# Altium schematic sheet SAM4N_Xplained_Pro_Target_MCU.SchDoc: Target MCU
size A3; Organization: ATMEL Norway; Address1: Vestre Rosten 79; Address2: N-7075 TILLER; Address3: NORWAY; DocumentNumber: A09-1967; Revision: 2; SheetNumber: 4; SheetTotal: 6; PageSetup: Record=PageOptions|CenterHorizontal=True|CenterVertical=True|PrintScale=1.01|XCorrection=1.00|YCorrection=1.00|PrintKind=1|BorderSize=5000000|LeftOffset=0|BottomOffset=0|Orientation=2|PaperLength=1000|PaperWidth=1000|Scale=100|PaperSource=7|PrintQuality=-4|MediaType=1|DitherType=10|PaperKind=A3 (297 x 420 mm)|PrintScaleMode=1
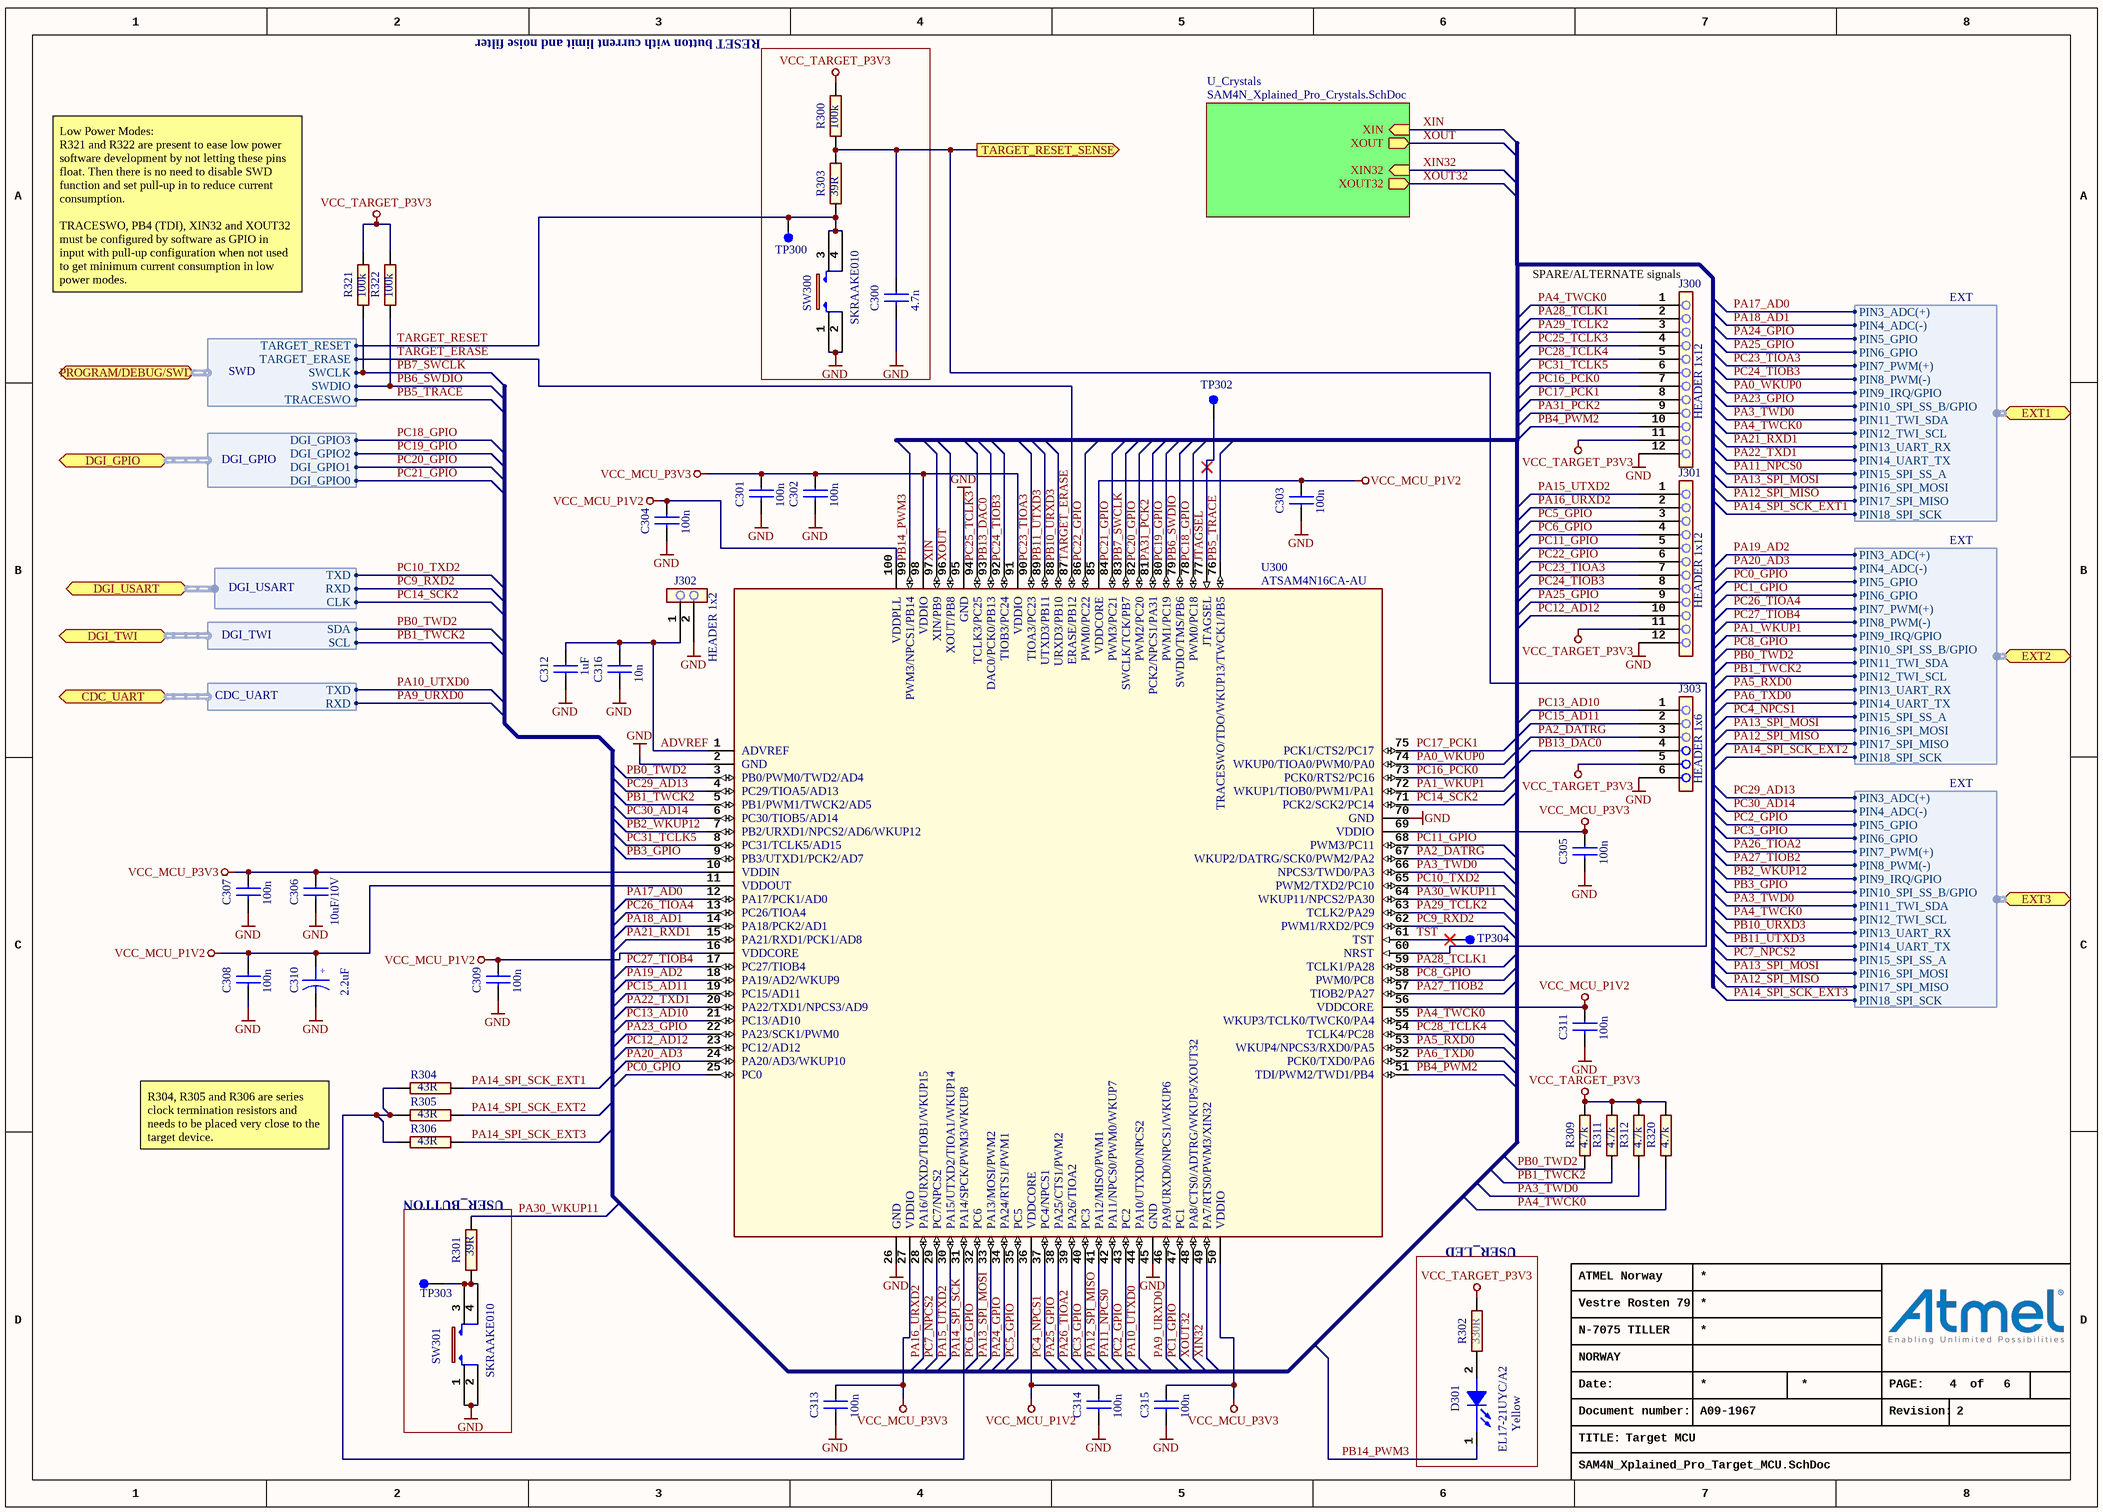
[diagram p0: SAM4N_Xplained_Pro_Target_MCU.SchDoc]

## Parts
C300  value 4.7n  [AP1-00001]  (hidden comment: CAP-NONPOL)
C301  value 100n  [AP1-00001]  (hidden comment: CAP-NONPOL)
C302  value 100n  [AP1-00001]  (hidden comment: CAP-NONPOL)
C303  value 100n  [AP1-00001]  (hidden comment: CAP-NONPOL)
C304  value 100n  [AP1-00001]  (hidden comment: CAP-NONPOL)
C305  value 100n  [AP1-00001]  (hidden comment: CAP-NONPOL)
C306  value 10uF/10V  [AP1-00039]  (hidden comment: CAP-NONPOL)
C307  value 100n  [AP1-00001]  (hidden comment: CAP-NONPOL)
C308  value 100n  [AP1-00001]  (hidden comment: CAP-NONPOL)
C309  value 100n  [AP1-00001]  (hidden comment: CAP-NONPOL)
C310  value 2.2uF  [AP1-00036]  (hidden comment: CAP-POL)
C311  value 100n  [AP1-00001]  (hidden comment: CAP-NONPOL)
C312  value 1uF  [AP1-00038]  (hidden comment: CAP-NONPOL)
C313  value 100n  [AP1-00001]  (hidden comment: CAP-NONPOL)
C314  value 100n  [AP1-00001]  (hidden comment: CAP-NONPOL)
C315  value 100n  [AP1-00001]  (hidden comment: CAP-NONPOL)
C316  value 10n  [AP1-00001]  (hidden comment: CAP-NONPOL)
D301  Yellow  value EL17-21UYC/A2  [AP4-00013]
J300  HEADER 1x12  [AP8-00677]
J301  HEADER 1x12  [AP8-00677]
J302  HEADER 1x2  [AP8-00733]
J303  HEADER 1x6  [AP8-00676]
R300  value 100k  [AP2-00000]  (hidden comment: R2)
R301  value 39R  [AP2-00000]  (hidden comment: R2)
R302  value 330R  [AP2-00000]  (hidden comment: R2)
R303  value 39R  [AP2-00000]  (hidden comment: R2)
R304  value 43R  [AP2-00000]  (hidden comment: R2)
R305  value 43R  [AP2-00000]  (hidden comment: R2)
R306  value 43R  [AP2-00000]  (hidden comment: R2)
R309  value 4.7k  [AP2-00000]  (hidden comment: R2)
R311  value 4.7k  [AP2-00000]  (hidden comment: R2)
R312  value 4.7k  [AP2-00000]  (hidden comment: R2)
R320  value 4.7k  [AP2-00000]  (hidden comment: R2)
R321  value 100k  [AP2-00000]  (hidden comment: R2)
R322  value 100k  [AP2-00000]  (hidden comment: R2)
SW300  value SKRAAKE010  [AP8-00137]  (hidden comment: Can be ordered in low volumes from Mouser)
SW301  value SKRAAKE010  [AP8-00137]  (hidden comment: Can be ordered in low volumes from Mouser)
TP300  TESTPAD  [AP8-00010]  (value not drawn)  (no BOM)
TP302  TESTPOINT  [AP8-00010]  (value not drawn)  (no BOM)
TP303  TESTPAD  [AP8-00010]  (value not drawn)  (no BOM)
TP304  TESTPOINT  [AP8-00010]  (value not drawn)  (no BOM)
U300  value ATSAM4N16CA-AU  [AP6-00292]  (hidden comment: SAM4N_100LPQF)

## Blocks framed on the sheet
RESET button with current limit and noise filter: C300 R300 R303 SW300 TP300
USER_BUTTON: R301 SW301 TP303
USER_LED: D301 R302

## Sub-sheets
U_Crystals = SAM4N_Xplained_Pro_Crystals.SchDoc: XIN (in), XOUT (out), XIN32 (in), XOUT32 (out)

## Ports
CDC_UART (harness CDC_UART), DGI_GPIO (harness DGI_GPIO), DGI_TWI (harness DGI_TWI), DGI_USART (harness DGI_USART), EXT1 (harness EXT), EXT2 (harness EXT), EXT3 (harness EXT), PROGRAM/DEBUG/SWD (harness SWD), TARGET_RESET_SENSE (out)

## Harnesses
SWD: SWCLK, SWDIO, TRACESWO, TARGET_RESET, TARGET_ERASE
DGI_GPIO: DGI_GPIO0, DGI_GPIO1, DGI_GPIO2, DGI_GPIO3
DGI_TWI: SCL, SDA
CDC_UART: RXD, TXD
EXT: PIN10_SPI_SS_B/GPIO, PIN11_TWI_SDA, PIN12_TWI_SCL, PIN13_UART_RX, PIN14_UART_TX, PIN15_SPI_SS_A, PIN16_SPI_MOSI, PIN17_SPI_MISO, PIN18_SPI_SCK, PIN3_ADC(+), PIN4_ADC(-), PIN5_GPIO, PIN6_GPIO, PIN7_PWM(+), PIN8_PWM(-), PIN9_IRQ/GPIO
DGI_USART: CLK, RXD, TXD

## Nets
GND: C300.2 C301.2 C302.2 C303.2 C304.2 C305.2 C306.2 C307.2 C308.2 C309.2 C310.2 C311.2 C312.2 C313.2 C314.2 C315.2 C316.2 J300.12 J301.12 J302.2 J303.6 SW300.1 SW300.2 SW301.1 SW301.2 U300.2(GND_2) U300.26(GND_26) U300.45(GND_45) U300.70(GND_70) U300.95(GND_95)
VCC_MCU_P1V2: C303.1 C304.1 C308.1 C309.1 C310.1 C311.1 C314.1 U300.11(VDDOUT) U300.16(VDDCORE_16) U300.36(VDDCORE_36) U300.56(VDDCORE_56) U300.85(VDDCORE_85) U300.100(VDDPLL)
VCC_MCU_P3V3: C301.1 C302.1 C305.1 C306.1 C307.1 C313.1 C315.1 U300.10(VDDIN) U300.27(VDDIO_27) U300.50(VDDIO_50) U300.69(VDDIO_69) U300.91(VDDIO_91) U300.98(VDDIO_98)
VCC_TARGET_P3V3: J300.11 J301.11 J303.5 R300.2 R302.2 R309.2 R311.2 R312.2 R320.2 R321.2 R322.2
ADVREF: C312.1 C316.1 J302.1 U300.1(ADVREF)
JTAGSEL: TP302.1 U300.77(JTAGSEL)
PA0_WKUP0: U300.74(PA0) ; port EXT1.PIN9_IRQ/GPIO
PA1_WKUP1: U300.72(PA1) ; port EXT2.PIN9_IRQ/GPIO
PA2_DATRG: J303.3 U300.67(PA2)
PA3_TWD0: R312.1 U300.66(PA3) ; port EXT1.PIN11_TWI_SDA, port EXT3.PIN11_TWI_SDA
PA4_TWCK0: J300.1 R320.1 U300.55(PA4) ; port EXT1.PIN12_TWI_SCL, port EXT3.PIN12_TWI_SCL
PA5_RXD0: U300.53(PA5) ; port EXT2.PIN13_UART_RX
PA6_TXD0: U300.52(PA6) ; port EXT2.PIN14_UART_TX
PA9_URXD0: U300.46(PA9) ; port CDC_UART.RXD
PA10_UTXD0: U300.44(PA10) ; port CDC_UART.TXD
PA11_NPCS0: U300.42(PA11) ; port EXT1.PIN15_SPI_SS_A
PA12_SPI_MISO: U300.41(PA12) ; port EXT1.PIN17_SPI_MISO, port EXT2.PIN17_SPI_MISO, port EXT3.PIN17_SPI_MISO
PA13_SPI_MOSI: U300.33(PA13) ; port EXT1.PIN16_SPI_MOSI, port EXT2.PIN16_SPI_MOSI, port EXT3.PIN16_SPI_MOSI
PA14_SPI_SCK: R304.2 R305.2 R306.2 U300.31(PA14)
PA14_SPI_SCK_EXT1: R304.1 ; port EXT1.PIN18_SPI_SCK
PA14_SPI_SCK_EXT2: R305.1 ; port EXT2.PIN18_SPI_SCK
PA14_SPI_SCK_EXT3: R306.1 ; port EXT3.PIN18_SPI_SCK
PA15_UTXD2: J301.1 U300.30(PA15)
PA16_URXD2: J301.2 U300.28(PA16)
PA17_AD0: U300.12(PA17) ; port EXT1.PIN3_ADC(+)
PA18_AD1: U300.14(PA18) ; port EXT1.PIN4_ADC(-)
PA19_AD2: U300.18(PA19) ; port EXT2.PIN3_ADC(+)
PA20_AD3: U300.24(PA20) ; port EXT2.PIN4_ADC(-)
PA21_RXD1: U300.15(PA21) ; port EXT1.PIN13_UART_RX
PA22_TXD1: U300.20(PA22) ; port EXT1.PIN14_UART_TX
PA23_GPIO: U300.22(PA23) ; port EXT1.PIN10_SPI_SS_B/GPIO
PA24_GPIO: U300.34(PA24) ; port EXT1.PIN5_GPIO
PA25_GPIO: J301.9 U300.38(PA25) ; port EXT1.PIN6_GPIO
PA26_TIOA2: U300.39(PA26) ; port EXT3.PIN7_PWM(+)
PA27_TIOB2: U300.57(PA27) ; port EXT3.PIN8_PWM(-)
PA28_TCLK1: J300.2 U300.59(PA28)
PA29_TCLK2: J300.3 U300.63(PA29)
PA30_WKUP11: R301.2 U300.64(PA30)
PA31_PCK2: J300.9 U300.81(PA31)
PB0_TWD2: R309.1 U300.3(PB0) ; port DGI_TWI.SDA, port EXT2.PIN11_TWI_SDA
PB1_TWCK2: R311.1 U300.5(PB1) ; port DGI_TWI.SCL, port EXT2.PIN12_TWI_SCL
PB2_WKUP12: U300.7(PB2) ; port EXT3.PIN9_IRQ/GPIO
PB3_GPIO: U300.9(PB3) ; port EXT3.PIN10_SPI_SS_B/GPIO
PB4_PWM2: J300.10 U300.51(PB4)
PB5_TRACE: U300.76(PB5) ; port PROGRAM/DEBUG/SWD.TRACESWO
PB6_SWDIO: R322.1 U300.79(PB6) ; port PROGRAM/DEBUG/SWD.SWDIO
PB7_SWCLK: R321.1 U300.83(PB7) ; port PROGRAM/DEBUG/SWD.SWCLK
PB10_URXD3: U300.88(PB10) ; port EXT3.PIN13_UART_RX
PB11_UTXD3: U300.89(PB11) ; port EXT3.PIN14_UART_TX
PB13_DAC0: J303.4 U300.93(PB13)
PB14_PWM3: D301.1(CATHODE) U300.99(PB14)
PC0_GPIO: U300.25(PC0) ; port EXT2.PIN5_GPIO
PC1_GPIO: U300.47(PC1) ; port EXT2.PIN6_GPIO
PC2_GPIO: U300.43(PC2) ; port EXT3.PIN5_GPIO
PC3_GPIO: U300.40(PC3) ; port EXT3.PIN6_GPIO
PC4_NPCS1: U300.37(PC4) ; port EXT2.PIN15_SPI_SS_A
PC5_GPIO: J301.3 U300.35(PC5)
PC6_GPIO: J301.4 U300.32(PC6)
PC7_NPCS2: U300.29(PC7) ; port EXT3.PIN15_SPI_SS_A
PC8_GPIO: U300.58(PC8) ; port EXT2.PIN10_SPI_SS_B/GPIO
PC9_RXD2: U300.62(PC9) ; port DGI_USART.RXD
PC10_TXD2: U300.65(PC10) ; port DGI_USART.TXD
PC11_GPIO: J301.5 U300.68(PC11)
PC12_AD12: J301.10 U300.23(PC12)
PC13_AD10: J303.1 U300.21(PC13)
PC14_SCK2: U300.71(PC14) ; port DGI_USART.CLK
PC15_AD11: J303.2 U300.19(PC15)
PC16_PCK0: J300.7 U300.73(PC16)
PC17_PCK1: J300.8 U300.75(PC17)
PC18_GPIO: U300.78(PC18) ; port DGI_GPIO.DGI_GPIO3
PC19_GPIO: U300.80(PC19) ; port DGI_GPIO.DGI_GPIO2
PC20_GPIO: U300.82(PC20) ; port DGI_GPIO.DGI_GPIO1
PC21_GPIO: U300.84(PC21) ; port DGI_GPIO.DGI_GPIO0
PC22_GPIO: J301.6 U300.86(PC22)
PC23_TIOA3: J301.7 U300.90(PC23) ; port EXT1.PIN7_PWM(+)
PC24_TIOB3: J301.8 U300.92(PC24) ; port EXT1.PIN8_PWM(-)
PC25_TCLK3: J300.4 U300.94(PC25)
PC26_TIOA4: U300.13(PC26) ; port EXT2.PIN7_PWM(+)
PC27_TIOB4: U300.17(PC27) ; port EXT2.PIN8_PWM(-)
PC28_TCLK4: J300.5 U300.54(PC28)
PC29_AD13: U300.4(PC29) ; port EXT3.PIN3_ADC(+)
PC30_AD14: U300.6(PC30) ; port EXT3.PIN4_ADC(-)
PC31_TCLK5: J300.6 U300.8(PC31)
TARGET_ERASE: U300.87(PB12) ; port PROGRAM/DEBUG/SWD.TARGET_ERASE
TARGET_RESET: R303.1 SW300.3 SW300.4 TP300.1 ; port PROGRAM/DEBUG/SWD.TARGET_RESET
TARGET_RESET_SENSE: C300.1 R300.1 R303.2 U300.60(NRST) ; port TARGET_RESET_SENSE
TST: TP304.1 U300.61(TST)
XIN: U300.97(PB9) ; sheet U_Crystals/XIN
XIN32: U300.49(PA7) ; sheet U_Crystals/XIN32
XOUT: U300.96(PB8) ; sheet U_Crystals/XOUT
XOUT32: U300.48(PA8) ; sheet U_Crystals/XOUT32
NetD301_2: D301.2(ANODE) R302.1
NetR301_1: R301.1 SW301.3 SW301.4 TP303.1

## Notes on the sheet
- Low Power Modes:
  R321 and R322 are present to ease low power software development by not letting these pins float. Then there is no need to disable SWD function and set pull-up in to reduce current consumption.
  TRACESWO, PB4 (TDI), XIN32 and XOUT32 must be configured by software as GPIO in input with pull-up configuration when not used to get minimum current consumption in low power modes.
- (near J300) SPARE/ALTERNATE signals
- R304, R305 and R306 are series clock termination resistors and needs to be placed very close to the target device.
- Date:
- PAGE:
- of
- TITLE:
- Document number:
- Revision:
- (in symbol A01-0492) +
- (in symbol A06-0963) PWM3/NPCS1/PB14; VDDIO; XIN/PB9; XOUT/PB8; GND; TCLK3/PC25; DAC0/PCK0/PB13; TIOB3/PC24; TIOA3/PC23; UTXD3/PB11; URXD3/PB10; ERASE/PB12; PWM0/PC22; VDDCORE; PWM3/PC21; SWCLK/TCK/PB7; PWM2/PC20; PCK2/NPCS1/PA31; PWM1/PC19; SWDIO/TMS/PB6; PWM0/PC18; TRACESWO/TDO/WKUP13/TWCK1/PB5; PCK1/CTS2/PC17; WKUP0/TIOA0/PWM0/PA0; PB0/PWM0/TWD2/AD4; PCK0/RTS2/PC16; PC29/TIOA5/AD13; WKUP1/TIOB0/PWM1/PA1; PB1/PWM1/TWCK2/AD5; PCK2/SCK2/PC14; PC30/TIOB5/AD14; PB2/URXD1/NPCS2/AD6/WKUP12; PC31/TCLK5/AD15; PWM3/PC11; PB3/UTXD1/PCK2/AD7; WKUP2/DATRG/SCK0/PWM2/PA2; NPCS3/TWD0/PA3; PWM2/TXD2/PC10; PA17/PCK1/AD0; WKUP11/NPCS2/PA30; PC26/TIOA4; TCLK2/PA29; PA18/PCK2/AD1; PWM1/RXD2/PC9; PA21/RXD1/PCK1/AD8; PC27/TIOB4; TCLK1/PA28; PA19/AD2/WKUP9; PWM0/PC8; PC15/AD11; TIOB2/PA27; PA22/TXD1/NPCS3/AD9; PC13/AD10; WKUP3/TCLK0/TWCK0/PA4; PA23/SCK1/PWM0; TCLK4/PC28; PC12/AD12; WKUP4/NPCS3/RXD0/PA5; PA20/AD3/WKUP10; PCK0/TXD0/PA6; TDI/PWM2/TWD1/PB4; PA16/URXD2/TIOB1/WKUP15; PC7/NPCS2; PA15/UTXD2/TIOA1/WKUP14; PA14/SPCK/PWM3/WKUP8; PA13/MOSI/PWM2; PA24/RTS1/PWM1; PC4/NPCS1; PA25/CTS1/PWM2; PA26/TIOA2; PA12/MISO/PWM1; PA11/NPCS0/PWM0/WKUP7; PA10/UTXD0/NPCS2; PA9/URXD0/NPCS1/WKUP6; PA8/CTS0/ADTRG/WKUP5/XOUT32; PA7/RTS0/PWM3/XIN32

## Library data of the parts
C300 = A01-0046: Ceramic capacitor, SMD 0402, X7R, 25V, +/-10% (de35287); PartGroup: Capacitors,Ceramic,SMD 0402; TemperatureRange: -55 - +125 deg C; AN: A01-0046; Tolerance: 25V, +/-10%; Height: 0.550000011920929
C301-C305 C307-C309 C311 C313-C315 = A01-0246: Ceramic capacitor, SMD 0402, X7R, 16V, +/-10%; PartGroup: Capacitors,Ceramic,SMD 0402; Manufacturer: Kemet; MPN: C0402C104K4RACTU; TemperatureRange: -55 - +125 deg C; AN: A01-0246; Tolerance: 16V, +/-10%; Height: 0,5
C306 = A01-0461: Ceramic capacitor, SMD 0603, X5R, 10V, 10UF ± 20%; PartGroup: Capacitors,Ceramic,SMD 0603; Manufacturer: AVX; MPN: 0603ZD106MAT2A; TemperatureRange: -55°C to +85°C; AN: A01-0461; Tolerance: ± 20%
C310 = A01-0492: Capacitor Tantalum 10V 2.2uF 10% ESR = 6 ohm; PartGroup: Capacitors,Tantalum; Manufacturer: Kemet; MPN: T494A225K010AT; TemperatureRange: - 55 C to + 125 C; AN: A01-0492; Tolerance: ±10%; Height: 1,79999995231628
C312 = A01-0447: Ceramic capacitor, SMD 0402, X5R, 10V, ±10 %; PartGroup: Capacitors,Ceramic,SMD 0402; Manufacturer: AVX; MPN: 0402ZD105KAT2A; AN: A01-0447; Height: 0.560000002384186
C316 = A01-0050: Ceramic capacitor, SMD 0402, X7R, 25V, +/-10%; PartGroup: Capacitors,Ceramic,SMD 0402; TemperatureRange: -55 - +125 deg C; AN: A01-0050; Tolerance: 25V, +/-10%; Height: 0.550000011920929
D301 = A10-0019: LED, Yellow, Wave length=591nm, SMD 0805, ±70°; PartGroup: Opto,LEDs,SMD; Manufacturer: Everlight; MPN: 17-21UYC/S530-A3/TR8; TemperatureRange: -40 to +85 deg C; AN: A10-0019; Height: 1,10000002384186
J300 J301 = A08-1617: 1x12 pin header, 2.54mm pitch, Pin-in-Paste THM; PartGroup: Mechanical devices,Connectors,Pin headers; Manufacturer: SAMTEC; Value: HMTSW-112-23-F-S-237; AN: A08-1617; Height: 6,09999990463257; MPN: HMTSW-112-23-F-S-237
J302 = A08-1754: 1x2 pin header, 2.54mm pitch, Pin-in-Paste THM; PartGroup: Mechanical devices,Connectors,Pin headers; Manufacturer: SAMTEC; Value: HMTSW-102-23-F-S-237; TemperatureRange: - 55 deg C to + 125 deg C; AN: A08-1754; Height: 6.09999990463257; MPN: HMTSW-102-23-F-S-237
J303 = A08-1616: 1x6 pin header, 2.54mm pitch, Pin-in-Paste THM; PartGroup: Mechanical devices,Connectors,Pin headers; Manufacturer: SAMTEC; Value: HMTSW-106-23-F-S-237; AN: A08-1616; Height: 6.09999990463257; MPN: HMTSW-106-23-F-S-237
R300 R321 R322 = A02-0260: Thick film resistor, SMD 0402, 1/16W, 1%; PartGroup: Resistors,SMD,0402 1%; TemperatureRange: -55 - +125 deg C; AN: A02-0260; Tolerance: 1 %; Height: 0,349999994039536
R301 R303 = A02-0178: Thick film resistor, SMD 0402, 1/16W, 1%; PartGroup: Resistors,SMD,0402 1%; TemperatureRange: -55 - +125 deg C; AN: A02-0178; Tolerance: 1 %; Height: 0,349999994039536
R302 = A02-0200: Thick film resistor, SMD 0402, 1/16W, 1%; PartGroup: Resistors,SMD,0402 1%; TemperatureRange: -55 - +125 deg C; AN: A02-0200; Tolerance: 1 %; Height: 0.349999994039536
R304-R306 = A02-0179: Thick film resistor, SMD 0402, 1/16W, 1%; PartGroup: Resistors,SMD,0402 1%; TemperatureRange: -55 - +125 deg C; AN: A02-0179; Tolerance: 1 %; Height: 0.349999994039536
R309 R311 R312 R320 = A02-0228: Thick film resistor, SMD 0402, 1/16W, 1%; PartGroup: Resistors,SMD,0402 1%; TemperatureRange: -55 - +125 deg C; AN: A02-0228; Tolerance: 1 %; Height: 0.349999994039536
SW300 SW301 = A08-0790: 6.2x6.2 mm SMD tact switch, same as A08-0091 but less force is needed; PartGroup: Mechanical devices,Switches,SMD; Manufacturer: ALPS; TemperatureRange: -30 - +90 deg C; AN: A08-0790; Height: 5,09999990463257; MPN: SKRAAKE010
TP300 TP302-TP304 = A08-0004: Single SMD testpad; PartGroup: Mechanical devices,Connectors,Test points; AN: A08-0004; Value: TESTPAD; Height: 0
U300 = A06-0963: ARM Cortex-M4 MCU with 1MB flash, 80KB SRAM; PartGroup: Integrated Circuits,MCU, MPU, DSP,Other; Manufacturer: ATMEL; TemperatureRange: -40°C to +85°C; AN: A06-0963; Height: 1.60000002384186; MPN: ATSAM4N16CA-AU